# EAGLE schematic V4-AddOnESP32-V002-cc1101 (EAGLE 9.3.0)
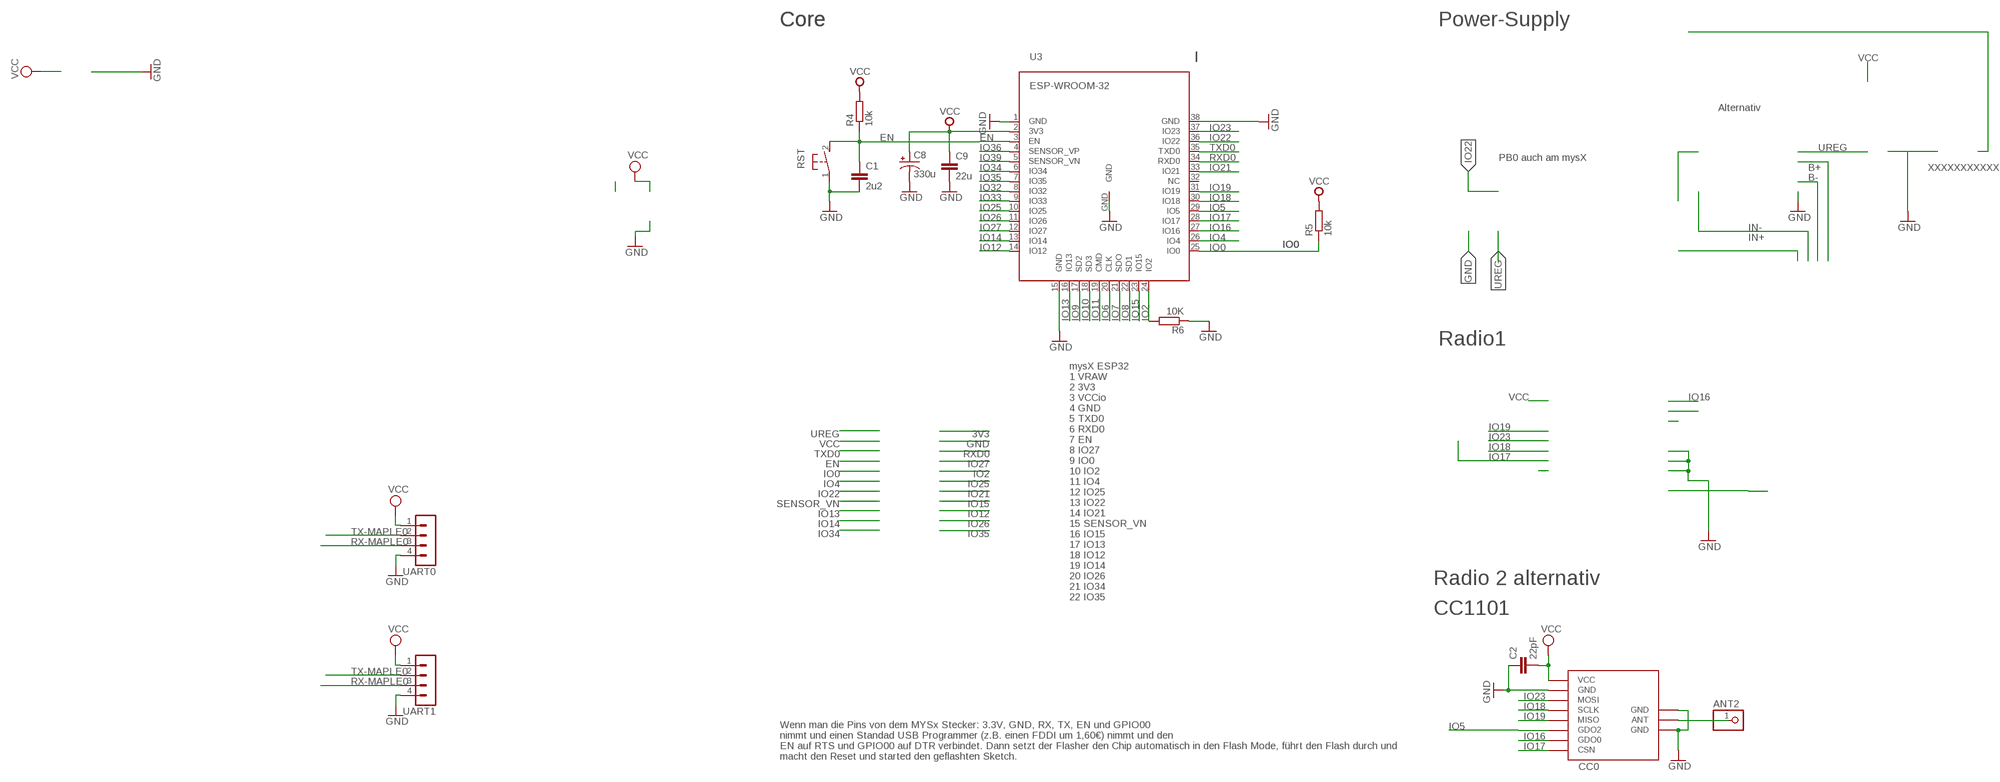
[diagram p0: schematic, sheet 1]

## Parts
ANT2  PINHD-1X1  [1X01]
C1  2u2  C-EUC0805  [C0805]
C2  22pF  C-EUC0805  [C0805]
C8  330u  CAP_POLSMD  [VISHAY_C]
C9  22u  C-EUC0805  [C0805]
CC0  CC1101  CC1101_MODULE1SMD  [CC1101_MODULE1_SMD]
R4  10k  R-EU_M0805  [M0805]
R5  10k  R-EU_R0603  [R0603]
R6  10K  R-EU_M0805  [M0805]
RST  DTSM-3  [DTSM-3]
U3  ESP-WROOM-32  [ESP-WROOM-32]
UART0  MA04-1  [MA04-1]
UART1  MA04-1  [MA04-1]

## Nets
ANT0: ANT2.1 CC0.ANT
EN: C1.1 R4.1 RST.2 U3.3(EN)
GND [gnd]: C1.2 C2.1 C8.- C9.2 CC0.GND@0(GND) CC0.GND@1(GND) CC0.GND@2(GND) R6.1 RST.1 U3.1(GND) U3.15(GND) U3.38(GND) U3.GND UART0.4 UART1.4
IO0: R5.1 U3.25(IO0)
IO2: R6.2 U3.24(IO2)
IO4: U3.26(IO4)
IO5: CC0.GDO2 U3.29(IO5)
IO6: U3.20(CLK)
IO7: U3.21(SDO)
IO8: U3.22(SD1)
IO9: U3.17(SD2)
IO10: U3.18(SD3)
IO11: U3.19(CMD)
IO12: U3.14(IO12)
IO13: U3.16(IO13)
IO14: U3.13(IO14)
IO15: U3.23(IO15)
IO16: CC0.GDO0 U3.27(IO16)
IO17: CC0.CSN U3.28(IO17)
IO18: CC0.SCLK U3.30(IO18)
IO19: CC0.MISO U3.31(IO19)
IO21: U3.33(IO21)
IO22: U3.36(IO22)
IO23: CC0.MOSI U3.37(IO23)
IO25: U3.10(IO25)
IO26: U3.11(IO26)
IO27: U3.12(IO27)
IO32: U3.8(IO32)
IO33: U3.9(IO33)
IO34: U3.6(IO34)
IO35: U3.7(IO35)
IO36: U3.4(SENSOR_VP)
IO39: U3.5(SENSOR_VN)
RX-MAPLE0: UART0.3 UART1.3
RXD0: U3.34(RXD0)
TX-MAPLE0: UART0.2 UART1.2
TXD0: U3.35(TXD0)
VCC [gnd]: C2.2 C8.+ C9.1 CC0.VCC R4.2 R5.2 U3.2(3V3) UART0.1 UART1.1
Unconnected: U3.32(NC)

## Notes on the sheet
- Core | Core | Power-Supply
- Alternativ
- PB0 auch am mysX
- XXXXXXXXXXX
- Radio1
- Radio 2 alternativ
- mysX ESP32
  1 VRAW
  2 3V3
  3 VCCio
  4 GND
  5 TXD0
  6 RXD0
  7 EN
  8 IO27
  9 IO0
  10 IO2
  11 IO4
  12 IO25
  13 IO22
  14 IO21
  15 SENSOR_VN
  16 IO15
  17 IO13
  18 IO12
  19 IO14
  20 IO26
  21 IO34
  22 IO35
- CC1101
- Wenn man die Pins von dem MYSx Stecker: 3.3V, GND, RX, TX, EN und GPIO00
  nimmt und einen Standad USB Programmer (z.B. einen FDDI um 1,60€) nimmt und den
  EN auf RTS und GPIO00 auf DTR verbindet. Dann setzt der Flasher den Chip automatisch in den Flash Mode, führt den Flash durch und
  macht den Reset und started den geflashten Sketch.

## Library data of the parts
ANT2 = pinhead:PINHD-1X1: PIN HEADER
C1 C9 = rcl@1:C-EU: CAPACITOR, European symbol; SPICEPREFIX: C
C2 = rcl:C-EU: CAPACITOR, European symbol
C8 = SparkFun-Passives:CAP_POL: Capacitor Polarized These are standard SMD and PTH capacitors. Normally 10uF, 47uF, and 100uF in electrolytic and tantalum varieties. Always verify the external diameter of the through hole cap, it varies with capacity, voltage, and manufacturer. The EIA devices should be standard.
CC0 = wireless:CC1101_MODULE1: CC1101 wireless module for 433/868 MHz (sold from Aliexpress). DIL version for mounting with pin header (and SMD soldering) and SMD only variant available.
R4 = rcl@1:R-EU_: RESISTOR, European symbol; SPICEPREFIX: R
R5 R6 = rcl:R-EU_: RESISTOR, European symbol
RST = switch-tact:DTSM-3
U3 = esp32:ESP-WROOM-32
UART0 UART1 = con-lstb:MA04-1: PIN HEADER; OC_FARNELL: unknown; OC_NEWARK: unknown

## Net classes
0 default: width 0.305 mm, clearance 0.205 mm
1 gnd: width 0.457 mm, drill 0.635 mm, clearance 0.254 mm
2 vcc: width 0.406 mm, drill 0.406 mm, clearance 0.254 mm